# Altium schematic sheet 09_PS2_Joystick.SchDoc
size A
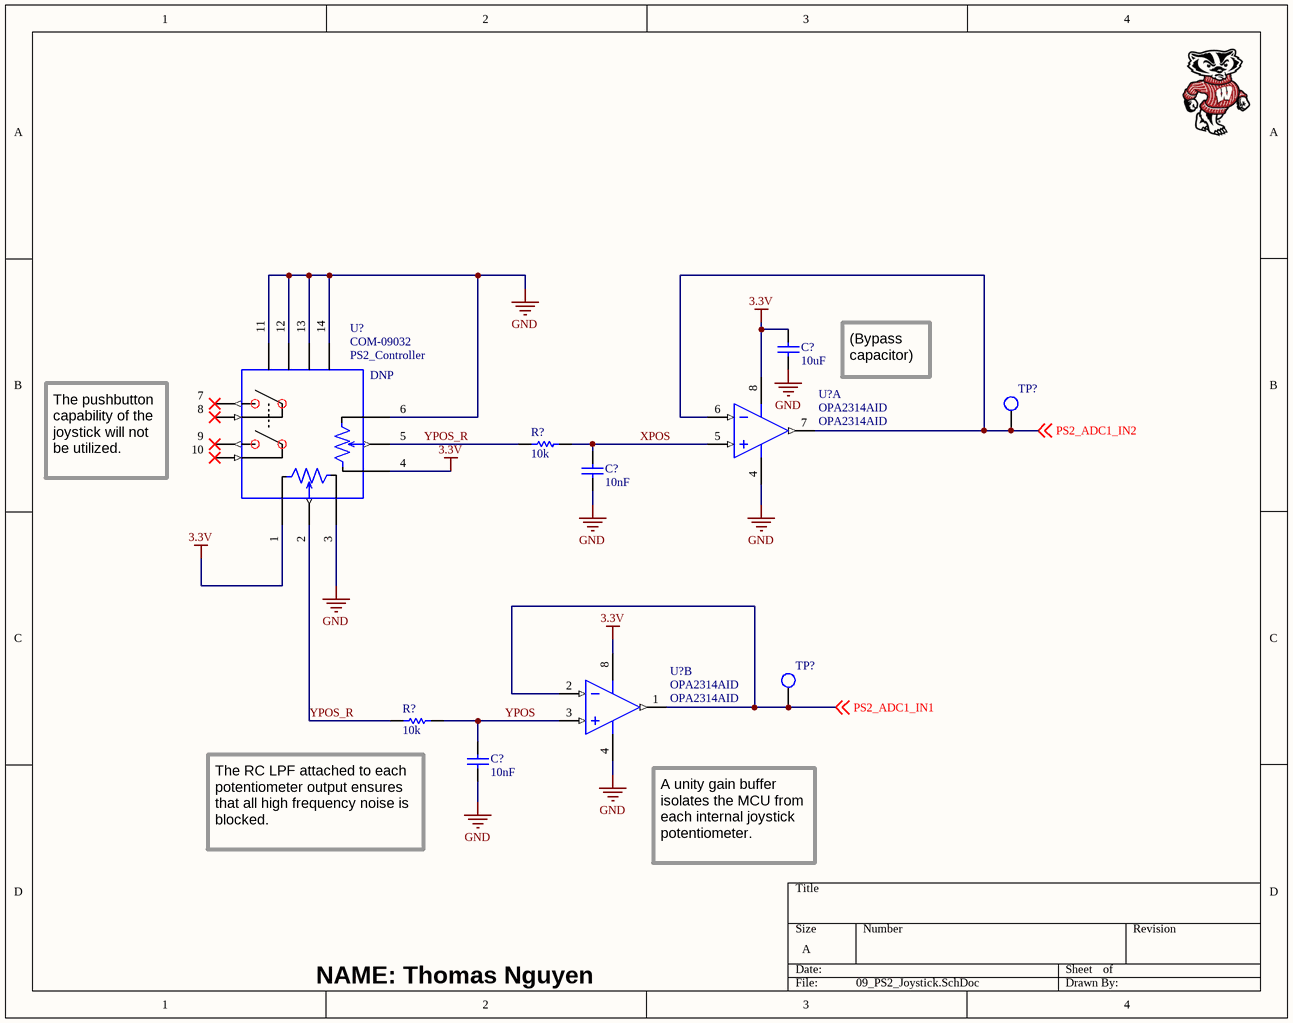
[diagram p0: 09_PS2_Joystick.SchDoc]

## Parts
(Parts that share a designator on the sheet are numbered #1, #2 ... from top to bottom, then left to right.)
C?#1  10uF  [CAP_0805]
C?#2  Capacitance: 10nF  (hidden comment: CAP_0805_N_010.00)
C?#3  Capacitance: 10nF  (hidden comment: CAP_0805_N_010.00)
R?#1  10K  [RES_0805]
R?#2  10K  [RES_0805]
TP?#1  TP_1206  [TP-SMC-1206]  (value not drawn)
TP?#2  TP_1206  [TP-SMC-1206]  (value not drawn)
U?#1  OPA2314AID  [D0008A_N]  (part A of 2)
U?#2  COM-09032  Name: PS2_Controller
U?#3  OPA2314AID  [D0008A_N]  (part B of 2)

## Nets
3.3V: C?#1.1 U?#1.8(V+) U?#2.1 U?#2.4 U?#3.8(V+)
GND: C?#1.2 C?#2.1 C?#3.1 U?#1.4(V-) U?#2.3 U?#2.6 U?#2.11 U?#2.12 U?#2.13 U?#2.14 U?#3.4(V-)
PS2_ADC1_IN1: TP?#2.1 U?#3.1(OUT_A) U?#3.2(IN_A-) ; off-sheet PS2_ADC1_IN1
PS2_ADC1_IN2: TP?#1.1 U?#1.6(IN_B-) U?#1.7(OUT_B) ; off-sheet PS2_ADC1_IN2
XPOS: C?#2.2 R?#1.2 U?#1.5(IN_B+)
YPOS: C?#3.2 R?#2.2 U?#3.3(IN_A+)
YPOS_R: R?#1.1 R?#2.1 U?#2.2 U?#2.5

Not connected (* = marked no-connect by the designer): U?#2 7* 8* 9* 10*

## Notes on the sheet
- (Bypass capacitor)
- (near U?#2) DNP
- The pushbutton capability of the joystick will not be utilized.
- The RC LPF attached to each potentiometer output ensures that all high frequency noise is blocked.
- (near U?#3) A unity gain buffer isolates the MCU from each internal joystick potentiometer.
- NAME: Thomas Nguyen

## Library data of the parts
C?#1 = CAP_0805_U_010.00: CAP CER 10UF 16V X7R 0805; Manufacturer: Samsung; Manufacturer Part Number: CL21A106KPCLQNC; Tolerance: 10%; Voltage Rating: 10V; Dielectric: X5R; ComponentLink3URL: https://datasheet.ciiva.com/26920/getdatasheetpartid-355170-26920201.pdf; ComponentLink3Description: https://datasheet.ciiva.com/26920/getdatasheetpartid-355170-26920201.pdf; Supplier 1: Digi-Key; Stock 1: 40000; Pricing 1: 1=0.22, 10=0.148, 100=0.0749, 500=0.05122, 1000=0.04531 (USD); Mount: Surface Mount; Case/Package: 0805; Case Code (Metric): 2012; Case Code (Imperial): 0805; Contact Plating: Tin; Min Operating Temperature: -55°C; Max Operating Temperature: 85°C; Packaging: Tape and Reel; Package Quantity: 1; Length: 2mm; Height: 0.85mm; Width: 0.049inch; Thickness: 0.037inch; Depth: 1.25mm; Radiation Hardening: No; ComponentLink1URL: https://datasheet.ciiva.com/25730/cl21a106kpclqnc-25730594.pdf; ComponentLink1Description: https://datasheet.ciiva.com/25730/cl21a106kpclqnc-25730594.pdf; Supplier Part Number 1: 1276-2402-1-ND; Capacitance: 10uF
C?#2 C?#3 = CAP_0805_N_010.00: KEMET - C0603C103KARACAUTO - SMD Multilayer Ceramic Capacitor, 10000 pF, 250 V, 0603 [1608 Metric], ± 10%, X7R; Voltage Rating: 250V; Supplier 1: Digi-Key; Supplier Part Number 1: 399-17960-1-ND; Manufacturer: KEMET; Manufacturer Part Number: C0603C103KARACAUTO; RoHS: No; Stock 1: 11770; Pricing 1: 1=0.95000, 10=0.72000, 100=0.51490, 500=0.39862, 1000=0.34326 (USD); Mount: Surface Mount; Case/Package: 0603; Case Code (Imperial): 0603; Case Code (Metric): 1608; Min Operating Temperature: -55°C; Max Operating Temperature: 125°C; Packaging: Tape and Reel; Tolerance: 10%; Ratings: AEC-Q200; ComponentLink1URL: http://www.farnell.com/datasheets/2748306.pdf?src-supplier=Farnell; ComponentLink1Description: http://www.farnell.com/datasheets/2748306.pdf?src-supplier=Farnell; ComponentLink2URL: http://www.farnell.com/datasheets/2748306.pdf?src-supplier=Newark; ComponentLink2Description: http://www.farnell.com/datasheets/2748306.pdf?src-supplier=Newark; ComponentLink3URL: http://www.farnell.com/datasheets/2748306.pdf?src-supplier=Element14; ComponentLink3Description: http://www.farnell.com/datasheets/2748306.pdf?src-supplier=Element14; ComponentLink4URL: https://api.kemet.com/component-edge/download/datasheet/C0603C103KARACAUTO.pdf?src-supplier=Digi-Key; ComponentLink4Description: https://api.kemet.com/component-edge/download/datasheet/C0603C103KARACAUTO.pdf?src-supplier=Digi-Key
R?#1 R?#2 = RES_0805_K_010.00: RES SMD 10K OHM 1% 1/8W 0805; Manufacturer: Panasonic / Panasonic ECG; Manufacturer Part Number: ERJ-6ENF1002V; Power Rating: 125mW; Temperature Coefficient: ± 200ppm/°C; Voltage Rating: 150V; Resistor Element Material: Thick Film; Resistor Case Style: 0805; No. of Pins: 2; Product Range: PANASONIC - ERJ Series; Supplier 1: Digikey; Stock 1: 87; Pricing 1: 1=0.1, 10=0.041, 100=0.0167, 1000=0.0075, 2500=0.0065 (USD); Series: ERJ; Supplier Part Number 1: P10.0KCCT-ND; Resistance: 10k; Resistance Tolerance: ± 1%; Resistor Mounting: SMD; Resistor Element Type: Thick Film; ComponentLink1URL: https://datasheet.ciiva.com/11808/0900766b80f80784-11808080.pdf; ComponentLink1Description: https://datasheet.ciiva.com/11808/0900766b80f80784-11808080.pdf; ComponentLink2URL: https://datasheet.ciiva.com/16514/aoa0000ce2-16514021.pdf; ComponentLink2Description: https://datasheet.ciiva.com/16514/aoa0000ce2-16514021.pdf; ComponentLink3URL: https://datasheet.ciiva.com/27055/1988971-27055733.pdf; ComponentLink3Description: https://datasheet.ciiva.com/27055/1988971-27055733.pdf; ComponentLink4URL: https://datasheet.ciiva.com/16759/70260748-16759350.pdf; ComponentLink4Description: https://datasheet.ciiva.com/16759/70260748-16759350.pdf; ComponentLink5URL: https://datasheet.ciiva.com/16725/70260748-16725031.pdf; ComponentLink5Description: https://datasheet.ciiva.com/16725/70260748-16725031.pdf; ComponentLink6URL: https://datasheet.ciiva.com/7830/426256-7830745.pdf; ComponentLink6Description: https://datasheet.ciiva.com/7830/426256-7830745.pdf; ComponentLink7URL: https://datasheet.ciiva.com/46372/1678782-46372714.pdf; ComponentLink7Description: https://datasheet.ciiva.com/46372/1678782-46372714.pdf; ComponentLink8URL: https://datasheet.ciiva.com/46372/1678782-46372715.pdf; ComponentLink8Description: https://datasheet.ciiva.com/46372/1678782-46372715.pdf; ComponentLink9URL: https://datasheet.ciiva.com/17212/aoa0000ce2-17212108.pdf; ComponentLink9Description: https://datasheet.ciiva.com/17212/aoa0000ce2-17212108.pdf; ComponentLink10URL: https://datasheet.ciiva.com/30140/aoa0000ce2-30140236.pdf; ComponentLink10Description: https://datasheet.ciiva.com/30140/aoa0000ce2-30140236.pdf; ComponentLink11URL: https://datasheet.ciiva.com/16740/aoa0000ce2-16740669.pdf; ComponentLink11Description: https://datasheet.ciiva.com/16740/aoa0000ce2-16740669.pdf; ComponentLink12URL: https://datasheet.ciiva.com/24070/aoa0000ce2-24070702.pdf; ComponentLink12Description: https://datasheet.ciiva.com/24070/aoa0000ce2-24070702.pdf
TP?#1 TP?#2 = TP_1206: Test Point SMD 1206; Manufacturer: TE Connectivity (Tyco Electronics); Manufacturer Part Number: 1625854-1; Resistance Value: 0 Ohm; Temperature Coefficient: N/R; Supplier 1: Digi-Key; Stock 1: 31937; Pricing 1: 1=0.28, 10=0.261, 25=0.224, 50=0.1902, 100=0.1828, 250=0.1641, 500=0.1567, 1000=0.1306 (USD); Case Size: 1206; Dimension: 3.2 x 1.6 x 1.25mm; Family: RC; Mounting: Surface Mount; Operating Temperature: -55 to 125 C; Part No: 1625854-1; RoHS: Yes; Packaging: Tape and Reel; Termination Style: N/R; Terminal Pitch: N/R; Power Rating: N/R; Tolerance: N/R; ComponentLink1URL: https://datasheet.ciiva.com/6439/eng-ds-1773266-a-6439169.pdf; ComponentLink1Description: https://datasheet.ciiva.com/6439/eng-ds-1773266-a-6439169.pdf; ComponentLink2URL: https://datasheet.ciiva.com/30136/1773266-a-30136341.pdf; ComponentLink2Description: https://datasheet.ciiva.com/30136/1773266-a-30136341.pdf; ComponentLink3URL: https://datasheet.ciiva.com/6439/eng-ds-1773266-a-6439080.pdf; ComponentLink3Description: https://datasheet.ciiva.com/6439/eng-ds-1773266-a-6439080.pdf; ComponentLink4URL: https://datasheet.ciiva.com/6439/eng-ds-1773266-a-6439081.pdf; ComponentLink4Description: https://datasheet.ciiva.com/6439/eng-ds-1773266-a-6439081.pdf; ComponentLink5URL: https://datasheet.ciiva.com/6439/eng-ds-1773266-a-6439083.pdf; ComponentLink5Description: https://datasheet.ciiva.com/6439/eng-ds-1773266-a-6439083.pdf; Supplier Part Number 1: A106143CT-ND
U?#1 U?#3 = OPA2314AID: Dual, 3MHz, Low-Power, Low-Noise, I/O, 1.8V CMOS Operational Amplifier 8-SOIC -40 to 125; Manufacturer: Texas Instruments; Max Supply Voltage: 5.5V; Min Dual Supply Voltage: 9V; Max Dual Supply Voltage: 2.75V; Common Mode Rejection Ratio: 75dB; Voltage Gain: 128dB; Number of Channels: 2; Slew Rate: 1.5V/µs; Max I/O Voltage: 2.5mV; Input Bias Current: 10pA; Operating Supply Current: 150uA; Output Current per Channel: 20mA; Power Supply Rejection Ratio (PSRR): 78dB; Supplier 1: Digi-Key; Supplier Part Number 1: 296-30336-5-ND; RoHS: Yes; Stock 1: 429; Pricing 1: 1=1.62000, 10=1.45800, 25=1.37520, 100=1.10000, 250=0.96252, 500=0.93500, 1000=0.74250, 2500=0.71500, 5000=0.68750 (USD); Case/Package: D; Number of Pins: 8; Min Operating Temperature: -40°C; Max Operating Temperature: 125°C; Min Supply Voltage: 1.8V; Gain Bandwidth Product: 3MHz; Unity Gain Bandwidth Product: 3MHz; Nominal Gain Bandwidth Product: 3MHz; Packaging: Rail/Tube; Package Quantity: 75; Input Offset Voltage (Vos): 2.5mV; Number of Circuits: 2; Number of Elements: 2; Output Current: 20mA; Nominal Supply Current: 150uA; Bandwidth: 3MHz; Number of Amplifiers: 2; Length: 5mm; Height: 1.5mm; Width: 4mm; Radiation Hardening: No; Lead Free: Lead Free; REACH SVHC: No SVHC; ComponentLink1URL: https://datasheet.ciiva.com/25630/0900766b8119b04f-25630783.pdf?src-supplier=RSComponents; ComponentLink1Description: https://datasheet.ciiva.com/25630/0900766b8119b04f-25630783.pdf?src-supplier=RSComponents; ComponentLink2URL: https://datasheet.ciiva.com/7848/1634049-7848148.pdf?src-supplier=Element14; ComponentLink2Description: https://datasheet.ciiva.com/7848/1634049-7848148.pdf?src-supplier=Element14; ComponentLink3URL: https://datasheet.ciiva.com/7219/1740466-7219734.pdf?src-supplier=Newark; ComponentLink3Description: https://datasheet.ciiva.com/7219/1740466-7219734.pdf?src-supplier=Newark; ComponentLink4URL: https://datasheet.ciiva.com/14456/opa2314-14456263.pdf?src-supplier=Avnet; ComponentLink4Description: https://datasheet.ciiva.com/14456/opa2314-14456263.pdf?src-supplier=Avnet; ComponentLink5URL: https://datasheet.ciiva.com/6627/opa2314-6627677.pdf?src-supplier=Digi-Key; ComponentLink5Description: https://datasheet.ciiva.com/6627/opa2314-6627677.pdf?src-supplier=Digi-Key; ComponentLink6URL: https://datasheet.ciiva.com/48706/001071969-da-01-en-ic-opamp-gp-rrio-3-opa2314aid-soic-8-tid-48706620.pdf?src-supplier=Conrad; ComponentLink6Description: https://datasheet.ciiva.com/48706/001071969-da-01-en-ic-opamp-gp-rrio-3-opa2314aid-soic-8-tid-48706620.pdf?src-supplier=Conrad; Category: Amplifiers - Op Amps, Buffer, Instrumentation; Manufacturer Part Number: OPA2314AID
U?#2 = COM-09032: JOYSTICK 10K OHM 2 AXIS TH; Manufacturer: SparkFun; Supplier 1: Digi-Key; Supplier Part Number 1: 1568-1526-ND; RoHS: No; Stock 1: 773; Pricing 1: 1=3.95000 (USD); ComponentLink1URL: https://media.digikey.com/pdf/Data%20Sheets/Sparkfun%20PDFs/COM-09032_Web.pdf?src-supplier=Digi-Key; ComponentLink1Description: https://media.digikey.com/pdf/Data%20Sheets/Sparkfun%20PDFs/COM-09032_Web.pdf?src-supplier=Digi-Key; Manufacturer Part Number: COM-09032